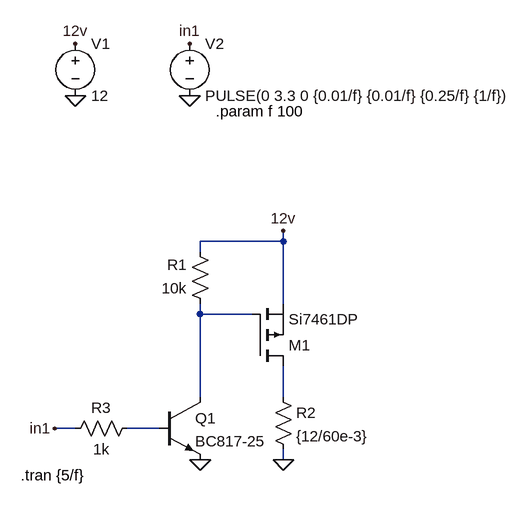
[diagram p0: schematic gpio_power_stage.asc]
gpio_power_stage.asc, the LTspice schematic file:
Version 4
SHEET 1 880 680
WIRE 240 0 240 -16
WIRE 240 0 112 0
WIRE 112 16 112 0
WIRE 240 96 240 0
WIRE 112 112 112 96
WIRE 192 112 112 112
WIRE 112 240 112 112
WIRE 240 240 240 192
WIRE -80 288 -112 288
WIRE 48 288 0 288
WIRE 240 336 240 320
FLAG 240 -16 12v
FLAG 112 336 0
FLAG 240 336 0
FLAG -112 288 in1
FLAG -80 -224 0
FLAG -80 -304 12v
FLAG 96 -304 in1
FLAG 96 -224 0
SYMBOL pmos 192 192 M180
SYMATTR InstName M1
SYMATTR Value Si7461DP
SYMBOL res 128 112 R180
WINDOW 0 36 76 Left 2
WINDOW 3 36 40 Left 2
SYMATTR InstName R1
SYMATTR Value 10k
SYMBOL res 224 224 R0
SYMATTR InstName R2
SYMATTR Value {12/60e-3}
SYMBOL npn 48 240 R0
SYMATTR InstName Q1
SYMATTR Value BC817-25
SYMBOL res 16 272 R90
WINDOW 0 0 56 VBottom 2
WINDOW 3 32 56 VTop 2
SYMATTR InstName R3
SYMATTR Value 1k
SYMBOL voltage -80 -320 R0
WINDOW 123 0 0 Left 0
WINDOW 39 0 0 Left 0
SYMATTR InstName V1
SYMATTR Value 12
SYMBOL voltage 96 -320 R0
WINDOW 123 0 0 Left 0
WINDOW 39 0 0 Left 0
SYMATTR InstName V2
SYMATTR Value PULSE(0 3.3 0 {0.01/f} {0.01/f} {0.25/f} {1/f})
TEXT 136 -200 Left 2 !.param f 100
TEXT -164 360 Left 2 !.tran {5/f}

The netlist it stands for:
* gpio_power_stage.asc
M1 N002 N001 12v 12v Si7461DP
R1 N001 12v 10k
R2 N002 0 {12/60e-3}
Q1 N001 N003 0 0 BC817-25
R3 N003 in1 1k
V1 12v 0 12
V2 in1 0 PULSE(0 3.3 0 {0.01/f} {0.01/f} {0.25/f} {1/f})
.model NPN NPN
.model PNP PNP
.lib standard.bjt
.model NMOS NMOS
.model PMOS PMOS
.lib standard.mos
.param f 100
.tran {5/f}
.backanno
.end